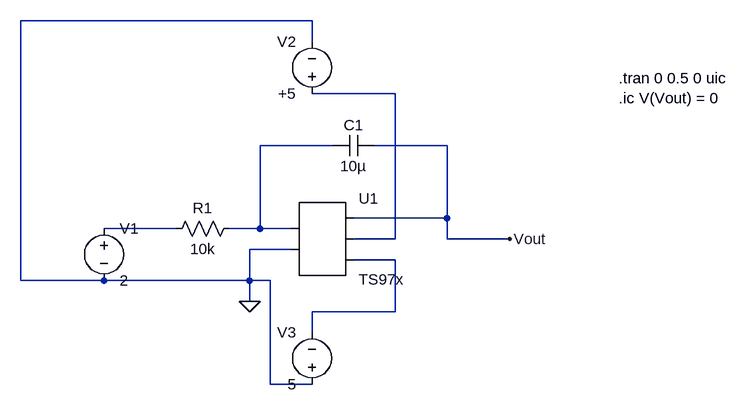
[diagram p0: schematic integrator_TS97x.asc]
integrator_TS97x.asc, the LTspice schematic file:
Version 4
SHEET 1 888 680
WIRE 160 -96 -288 -96
WIRE 160 -64 160 -96
WIRE 288 16 160 16
WIRE 192 96 80 96
WIRE 368 96 256 96
WIRE 368 208 368 96
WIRE 368 208 224 208
WIRE -48 224 -160 224
WIRE 80 224 80 96
WIRE 80 224 32 224
WIRE 128 224 80 224
WIRE 288 240 288 16
WIRE 288 240 224 240
WIRE 368 240 368 208
WIRE 464 240 368 240
WIRE 128 256 64 256
WIRE 288 272 224 272
WIRE -288 304 -288 -96
WIRE -160 304 -288 304
WIRE 64 304 64 256
WIRE 64 304 -160 304
WIRE 96 304 64 304
WIRE 64 336 64 304
WIRE 288 352 288 272
WIRE 288 352 160 352
WIRE 160 384 160 352
WIRE 96 464 96 304
WIRE 160 464 96 464
FLAG 64 336 0
FLAG 464 240 Vout
SYMBOL res 48 208 R90
WINDOW 0 0 56 VBottom 2
WINDOW 3 32 56 VTop 2
SYMATTR InstName R1
SYMATTR Value 10k
SYMBOL cap 256 80 R90
WINDOW 0 0 32 VBottom 2
WINDOW 3 32 32 VTop 2
SYMATTR InstName C1
SYMATTR Value 10µ
SYMBOL voltage -160 208 R0
SYMATTR InstName V1
SYMATTR Value 2
SYMBOL voltage 160 32 R180
WINDOW 0 24 96 Left 2
WINDOW 3 24 16 Left 2
SYMATTR InstName V2
SYMATTR Value +5
SYMBOL voltage 160 480 R180
WINDOW 0 24 96 Left 2
WINDOW 3 24 16 Left 2
SYMATTR InstName V3
SYMATTR Value 5
SYMBOL AutoGenerated/TS97x 176 240 R0
SYMATTR InstName U1
TEXT 632 -8 Left 2 !.tran 0 0.5 0 uic\n.ic V(Vout) = 0

The netlist it stands for:
* integrator_TS97x.asc
R1 N002 N003 10k
C1 Vout N002 10µ
V1 N003 0 2
V2 N001 0 +5
V3 0 N004 5
* U1: TS97x (symbol AutoGenerated/TS97x not available, pins judged from their places): pin1=N002 pin2=0 pin3=Vout pin4=N001 pin5=N004
.tran 0 0.5 0 uic
.ic V(Vout) = 0
.backanno
.end